# EAGLE design E6_Esp32_TS26C01_v3 (EAGLE 6.6.0)

## Sheet 1 of 2
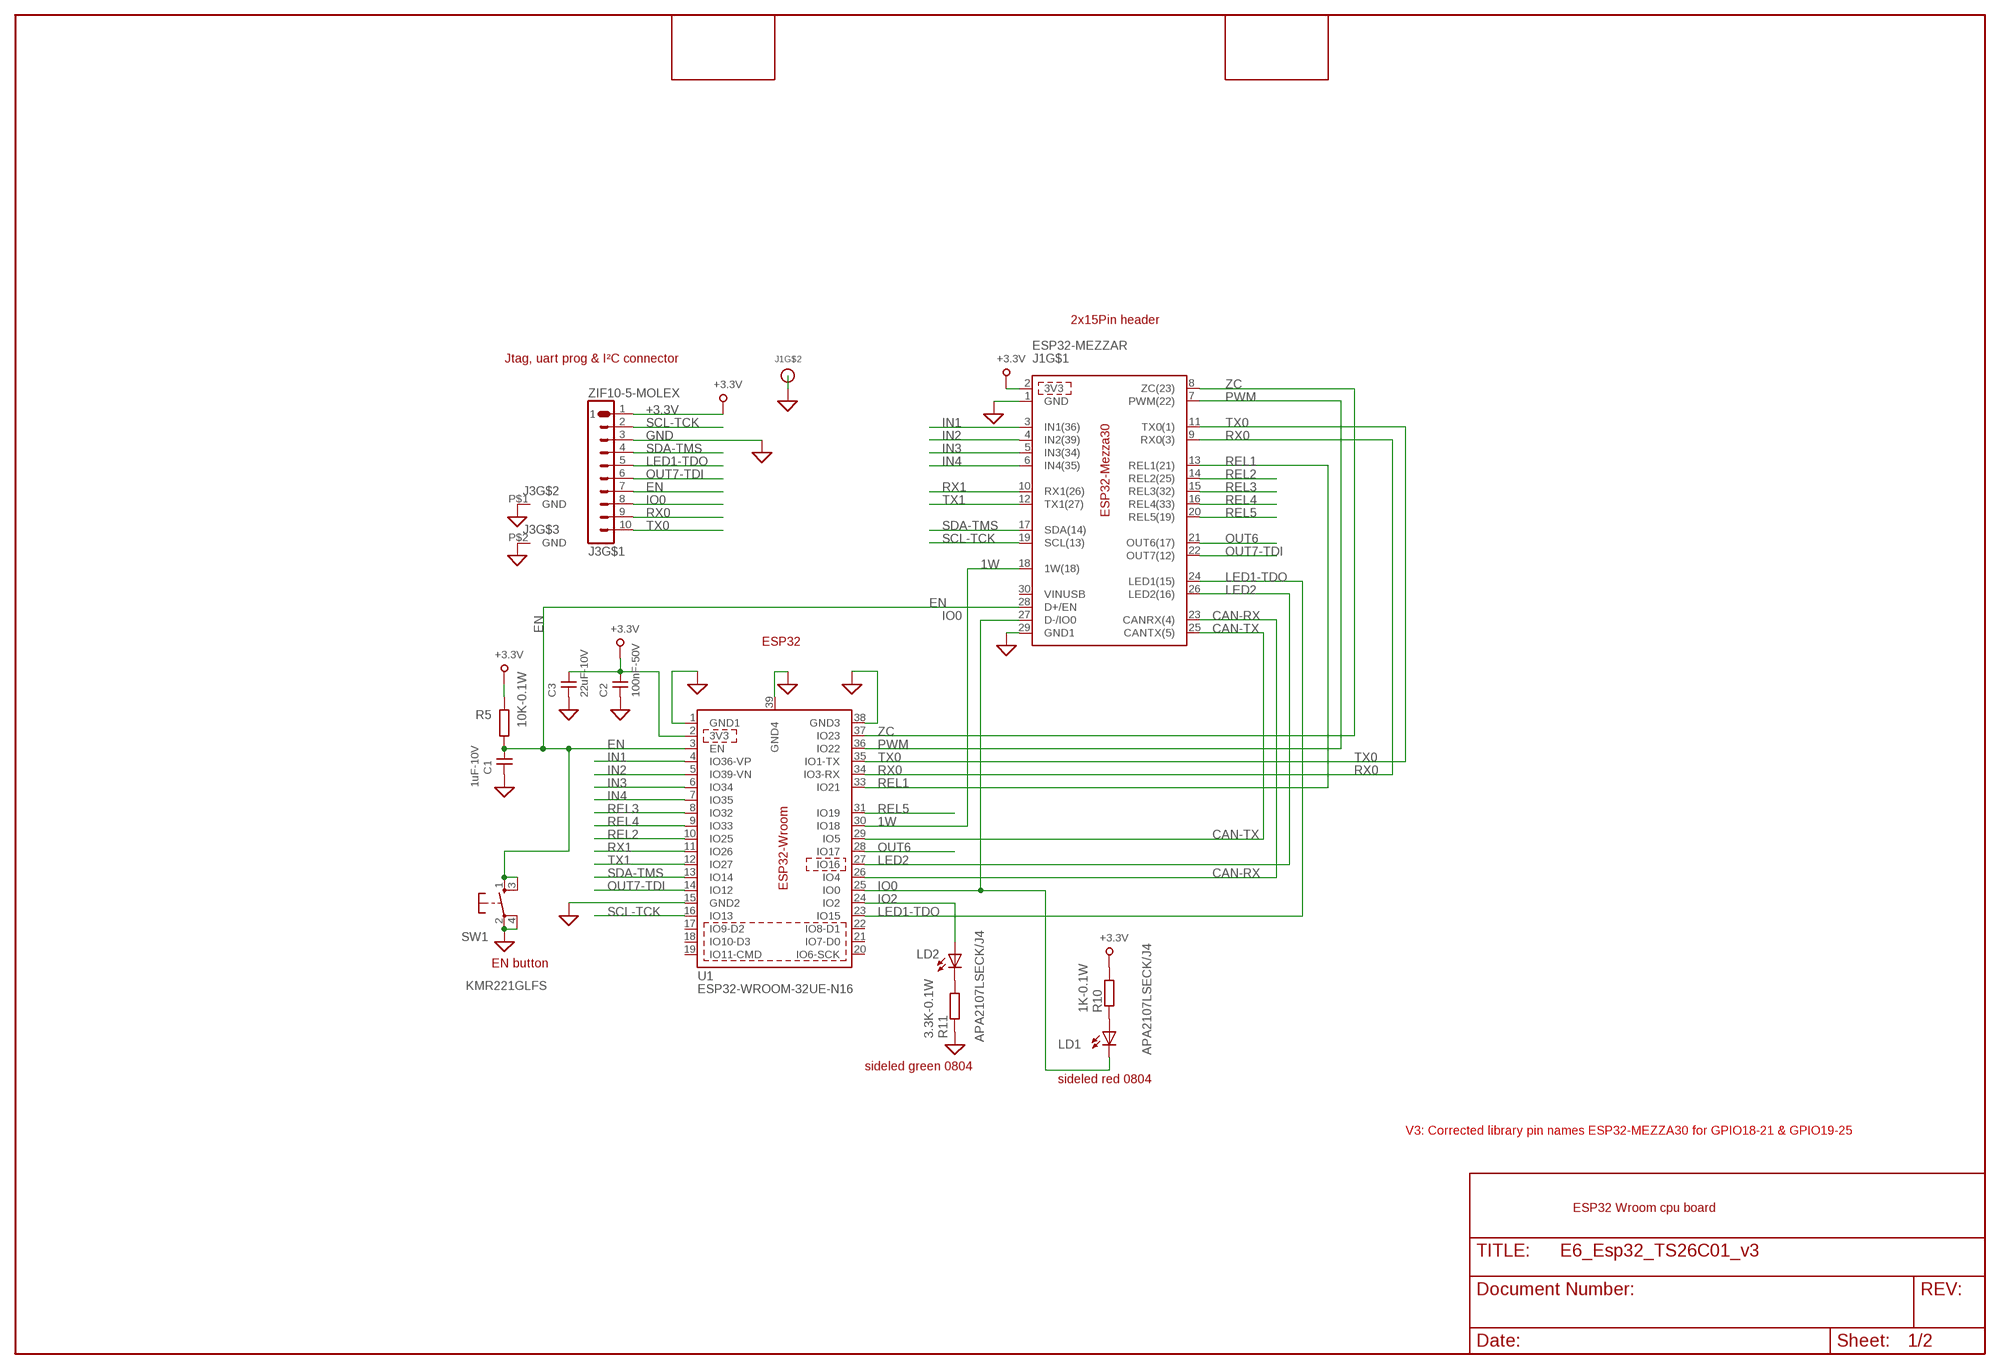
[diagram p0: schematic, sheet 1]

### Parts
C1  1uF-10V  CAP-0603-L  [C0603]
C2  100nF-50V  CAP-0603-L  [C0603]
C3  22uF-10V  CAP-0603-L  [C0603]
J1  ESP32-MEZZAR  [ESP32-MEZZA25-R]
J3  ZIF10-5-MOLEX  ZIF10-5-MOLEXSTD  [52746-1071-J]
LD1  APA2107LSECK/J4  SIDELED_0805  [SIDELED_0805]
LD2  APA2107LSECK/J4  SIDELED_0805  [SIDELED_0805]
R5  10K-0.1W  R-EU_R0603-S  [0603]
R10  1K-0.1W  R-EU_R0603-S  [0603]
R11  3.3K-0.1W  R-EU_R0603-S  [0603]
SW1  KMR221GLFS  SW-TACT-NOGNDSIDE  [SW-KMS-HOLE-NOGND]
U1  ESP32-WROOM-32UE-N16  ESP32-WROOM-UE  [ESP32-WROOM-32UE]

### Nets
1W: J1.18(1W(18)) U1.30(IO18)
+3.3V: C2.2 C3.2 J1.2(3V3) J3.1 R5.1 R10.1 U1.2(3V3)
CAN-RX: J1.23(CANRX(4)) U1.26(IO4)
CAN-TX: J1.25(CANTX(5)) U1.29(IO5)
EN: C1.2 J1.28(D+/EN) J3.7 R5.2 SW1.1(S) SW1.3(S) U1.3(EN)
GND: C1.1 C2.1 C3.1 J1.1(GND) J1.29(GND1) J1.31 J3.3 J3.P$1(GND) J3.P$2(GND) R11.2 SW1.2(P) SW1.4(P) U1.1(GND1) U1.15(GND2) U1.38(GND3) U1.39(GND4)
IN1: J1.3(IN1(36)) U1.4(IO36-VP)
IN2: J1.4(IN2(39)) U1.5(IO39-VN)
IN3: J1.5(IN3(34)) U1.6(IO34)
IN4: J1.6(IN4(35)) U1.7(IO35)
IO0: J1.27(D-/IO0) J3.8 LD1.C U1.25(IO0)
IO2: LD2.A U1.24(IO2)
LED1-TDO: J1.24(LED1(15)) J3.5 U1.23(IO15)
LED2: J1.26(LED2(16)) U1.27(IO16)
N$3: LD1.A R10.2
N$4: LD2.C R11.1
OUT6: J1.21(OUT6(17)) U1.28(IO17)
OUT7-TDI: J1.22(OUT7(12)) J3.6 U1.14(IO12)
PWM: J1.7(PWM(22)) U1.36(IO22)
REL1: J1.13(REL1(21)) U1.33(IO21)
REL2: J1.14(REL2(25)) U1.10(IO25)
REL3: J1.15(REL3(32)) U1.8(IO32)
REL4: J1.16(REL4(33)) U1.9(IO33)
REL5: J1.20(REL5(19)) U1.31(IO19)
RX0: J1.9(RX0(3)) J3.9 U1.34(IO3-RX)
RX1: J1.10(RX1(26)) U1.11(IO26)
SCL-TCK: J1.19(SCL(13)) J3.2 U1.16(IO13)
SDA-TMS: J1.17(SDA(14)) J3.4 U1.13(IO14)
TX0: J1.11(TX0(1)) J3.10 U1.35(IO1-TX)
TX1: J1.12(TX1(27)) U1.12(IO27)
ZC: J1.8(ZC(23)) U1.37(IO23)
Unconnected: J1.30(VINUSB) U1.17(IO9-D2) U1.18(IO10-D3) U1.19(IO11-CMD) U1.20(IO6-SCK) U1.21(IO7-D0) U1.22(IO8-D1)

### Notes on the sheet
- 2x15Pin header
- Jtag, uart prog & I²C connector
- ESP32
- EN button
- sideled green 0804
- sideled red 0804
- V3: Corrected library pin names ESP32-MEZZA30 for GPIO18-21 & GPIO19-25
- ESP32 Wroom cpu board

## Sheet 2 of 2
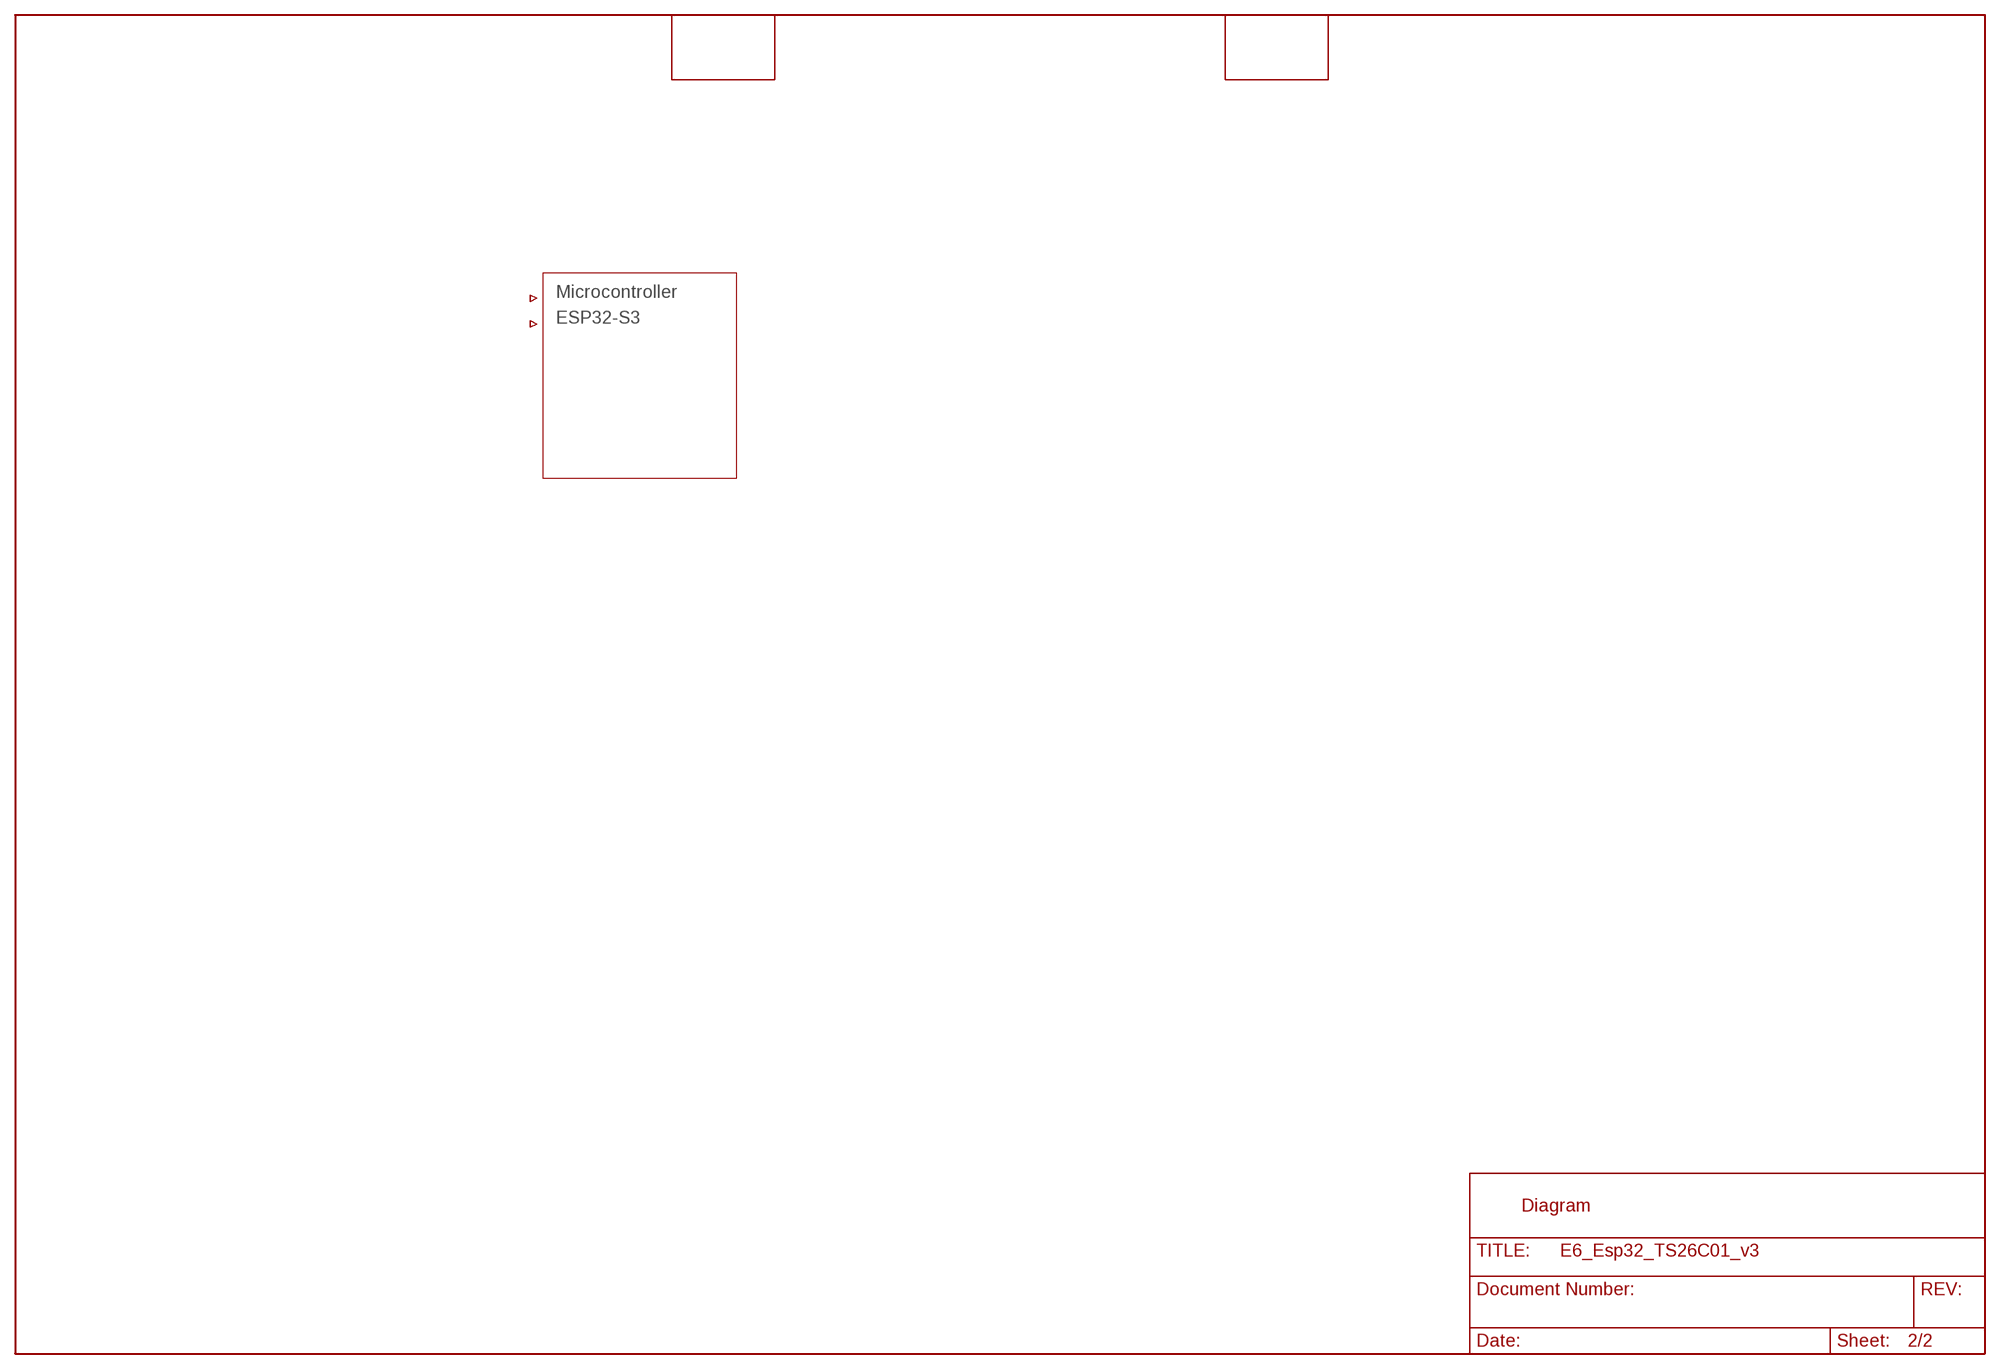
[diagram p1: schematic, sheet 2]

### Notes on the sheet
- Microcontroller
- ESP32-S3
- Diagram

## Power pins joined to a net without a drawn wire
GND: J3.P$3(GND) J3.P$5(GND)

## Library data of the parts
C1-C3 = JLB_smd:CAP-0603
J1 = JLB_Processor:ESP32-MEZZA: Module ESP32 40mm 2x15x2.0mm vertical, horizontal, normal, reverse
J3 = JLB_Connec:ZIF10-5-MOLEX
LD1 LD2 = JLB_Display:SIDELED_0805: Sideled 0805 kingbright APA2107 can be used for standard led
R5 R10 R11 = JLB_smd:R-EU_: RESISTOR, European symbol
SW1 = JLB_Connec:SW-TACT-NOGND: Tactile button C&K KMR
U1 = JLB_Processor:ESP32-WROOM-UE: SOC ESP32-Wroom E antene pcb

## Board
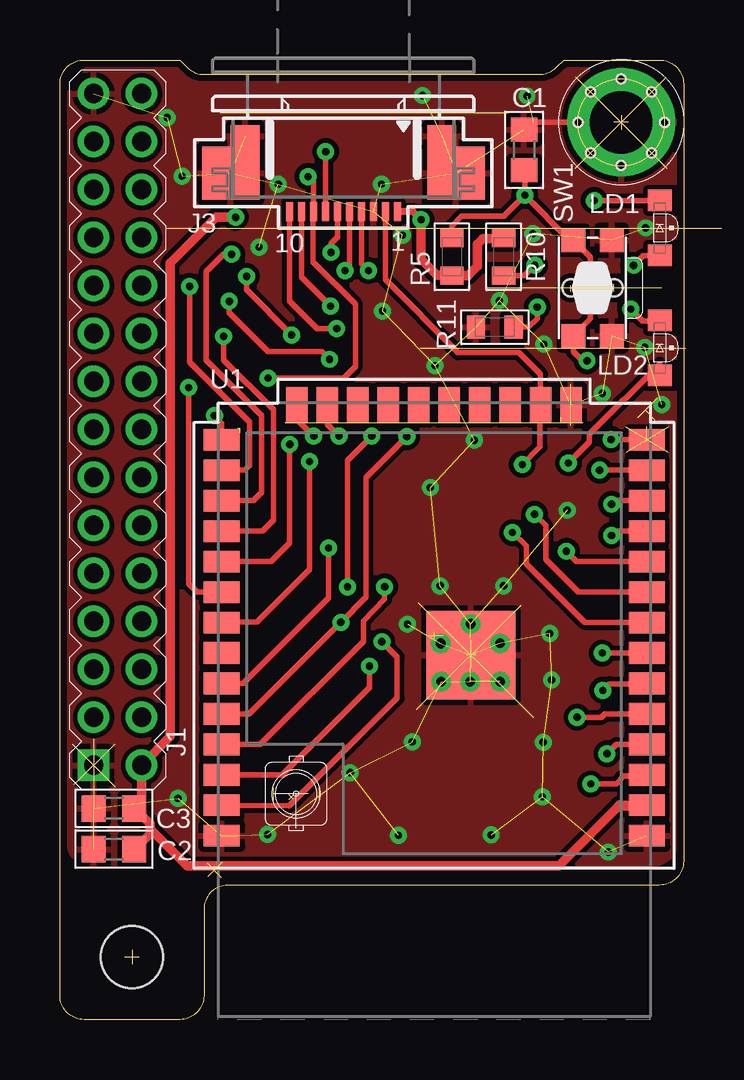
[diagram p2: board, top side]
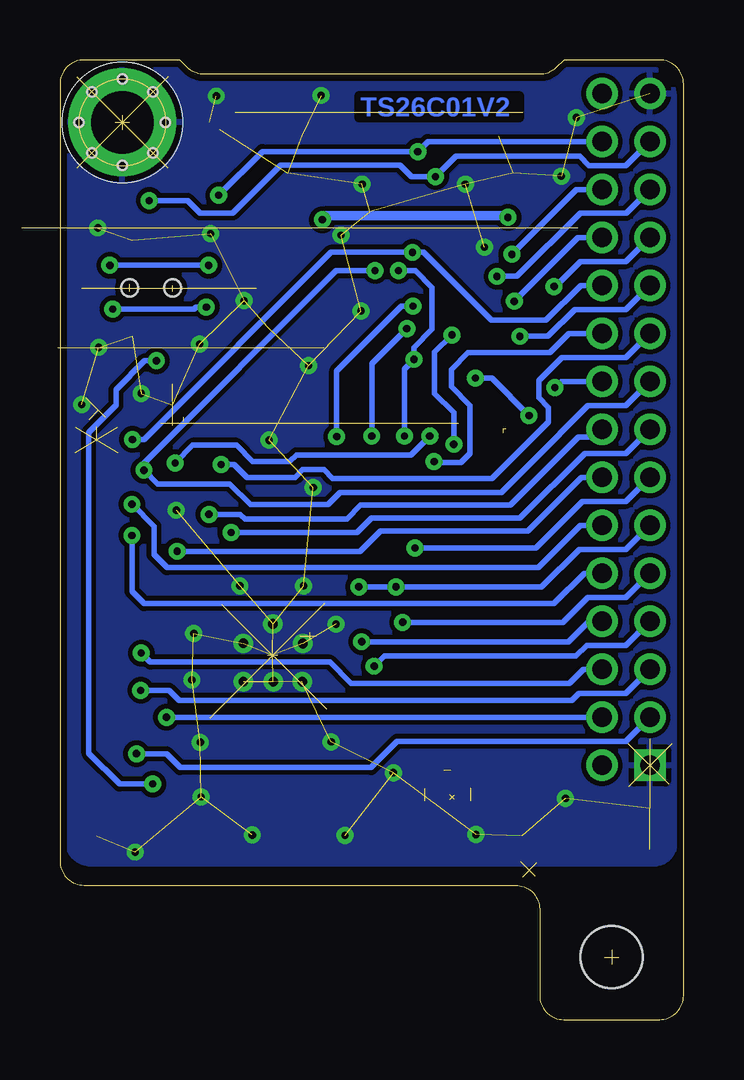
[diagram p3: board, bottom side, seen from below]

Size 26 x 40 mm. Coordinates in mm from the lower left corner, seen from the top.
Copper layers (1*16): Top 0.035mm / dielectric 1.5mm / Bottom 0.035mm
Design rules "default": minimum track width 9mil, minimum drill 10mil, track to track 7mil, track to pad 7mil, pad to pad 7.5mil, via to via 8mil, smd to smd 0mil, copper to edge 10mil, drill to drill 8mil, minimum pad ring 10mil, minimum via ring 8mil, stop-mask expansion 1mil, vias tented up to drill 19mil, thermal gap 9mil
bRestrict: 4 lines
Milling: 13 lines

### Footprints (pad centres in the part's own frame; a part is rotated, then mirrored left to right if it is on the bottom)
C0603 = smd 1 x 1.1: 1 -0.85,0; 2 0.85,0
ESP32-MEZZA25-R = drill 0.8 square: 1 1.4,10.6 | drill 0.8: 2 3.4,10.6; 3 1.4,12.6; 4 3.4,12.6; 5 1.4,14.6; 6 3.4,14.6; 7 1.4,16.6; 8 3.4,16.6; 9 1.4,18.6; 10 3.4,18.6; 11 1.4,20.6; 12 3.4,20.6; 13 1.4,22.6; 14 3.4,22.6; 15 1.4,24.6; 16 3.4,24.6; 17 1.4,26.6; 18 3.4,26.6; 19 1.4,28.6; 20 3.4,28.6; 21 1.4,30.6; 22 3.4,30.6; 23 1.4,32.6; 24 3.4,32.6; 25 1.4,34.6; 26 3.4,34.6; 27 1.4,36.6; 28 3.4,36.6; 29 1.4,38.6; 30 3.4,38.6 | drill 2.6 pad 4.5: 31 23.4,37.4 | hole 0.381: 22.13,38.67; 24.665,36.131; 23.4,39.2; 24.67,38.67; 25.2,37.4; 23.4,35.6; 22.134,36.125; 21.6,37.4 | hole 2.6: 3,2.6
52746-1071-J = smd 0.3 x 0.8: 1 -2.25,2.5; 2 -1.75,2.5; 3 -1.25,2.5; 4 -0.75,2.5; 5 -0.25,2.5; 6 0.25,2.5; 7 0.75,2.5; 8 1.25,2.5; 9 1.75,2.5; 10 2.25,2.5 | smd 2.4 x 2.2: P$1 -4.7,0.9; P$2 4.7,0.9 | smd 1.2 x 0.9: P$3 4.1,-0.65; P$5 -4.1,-0.65
SIDELED_0805 = smd 1 x 0.9: A 0,-1.15; C 0,1.15
0603 = smd 0.965 x 0.762: 1 0,0.787; 2 0,-0.787
SW-KMS-HOLE-NOGND = smd 1 x 1: 1 0.8,-2; 2 -0.8,-2; 3 0.8,2; 4 -0.8,2 | hole 0.7: -0.9,0; 0.9,0
ESP32-WROOM-32UE = smd 1.5 x 0.9: 1 -8.874,8.34; 2 -8.874,7.07; 3 -8.874,5.8; 4 -8.874,4.53; 5 -8.874,3.26; 6 -8.874,1.99; 7 -8.874,0.72; 8 -8.874,-0.55; 9 -8.874,-1.82; 10 -8.874,-3.09; 11 -8.874,-4.36; 12 -8.874,-5.63; 13 -8.874,-6.9; 14 -8.874,-8.17; 25 8.855,-8.17; 26 8.855,-6.9; 27 8.855,-5.63; 28 8.855,-4.36; 29 8.855,-3.09; 30 8.855,-1.82; 31 8.855,-0.55; 32 8.855,0.72; 33 8.855,1.99; 34 8.855,3.26; 35 8.855,4.53; 36 8.855,5.8; 37 8.855,7.07; 38 8.855,8.34 | smd 0.9 x 1.5: 15 -5.71,-9.621; 16 -4.44,-9.621; 17 -3.17,-9.621; 18 -1.9,-9.621; 19 -0.63,-9.621; 20 0.64,-9.621; 21 1.91,-9.621; 22 3.18,-9.621; 23 4.45,-9.621; 24 5.72,-9.621 | smd 3.7 x 3.7: 39 -1.53,0.81

### Placement (x,y rotation side)
C1  19.35,36.25 270 top
C2  2.25,7.1 0 top
C3  2.25,8.8 0 top
J1  0,0 0 top
J3  11.82,36.18 180 top
LD1  25,33 0 top
LD2  25,28 0 top
R5  16.34,31.8 180 top
R10  18.5,31.8 0 top
R11  18.13,28.86 270 top
SW1  22.2,30.5 180 top
U1  15.6,16 180 top

### Tracks (layer width: path | path; a pad name or v marks a point on that pad's centre or on a via)
1W  (via drill 0.3)
  Top 0.23: 6.76,17.84 U1.30 | v5.36,26.34 5.36,18.18 5.72,17.82 U1.30 | U1.30
  Bottom 0.23: J1.18 5.1,26.6 v5.36,26.34
+3.3V  (via drill 0.3)
  Top 0.3: v15.06,33.34 14.72,33.68 J3.1 | R10.1 18.4,32.58 18.39,32.59
  Top 0.4: 23.3,8.9 20.8,6.4 5.3,6.4 3.75,7.95 | 3.75,7.95 3.75,8.15 C3.2 3.4,9.1 J1.2 4.6,11.8 4.6,31.53 6.51,33.44 v7.32,33.44 | 3.75,7.95 3.75,7.75 C2.2 | v15.06,33.34 15.06,31.7 15.72,31.04 16.34,31.04 R5.1 17.01,31.01 17.4,31.4 17.4,32.32 17.64,32.56 18.5,32.56 R10.1
  Top 0.406: U1.2 | 23.3,8.9 23.33,8.93 U1.2
  Bottom 0.4: v7.32,33.44 7.3,33.44 7.38,33.52 14.88,33.52 v15.06,33.34
CAN-RX  (via drill 0.3)
  Top 0.23: U1.26 7.7,22.9 7.9,23.1 7.9,24.9 5.4,27.41 v5.4,30.56
  Bottom 0.23: J1.23 2.4,31.6 4.3,31.6 5.22,30.68 v5.4,30.56
CAN-TX  (via drill 0.3)
  Top 0.23: U1.29 8.81,19.09 9.58,19.86 v9.58,23.98 | v7.78,30.98 7.78,30.42 v9.66,28.54
  Bottom 0.23: J1.25 2.39,33.61 4.31,33.61 6.94,30.98 v7.78,30.98 | v9.58,23.98 9.58,25.3 10.38,26.1 10.38,27.82 v9.66,28.54
EN  (via drill 0.3)
  Top 0.23: U1.3 24.47,10.15 23.52,10.15 23.19,9.82 v22.13,9.82 | J3.7 v11.08,36.18 | C1.2 19.38,35.38 v19.38,34.36 | v21.98,27.46 21.78,27.46 21.4,27.84 SW1.3 | SW1.3 21.4,28.52 | v19.38,34.36 21.24,32.5 SW1.1 22.12,31.78 22.12,29.22 SW1.3 | R5.2 16.34,33.08 16.74,33.48 18.5,33.48 v19.38,34.36
  Bottom 0.23: v22.13,9.82 23.52,9.82 24.8,11.1 24.8,24.47 23.66,25.61 23.66,26.26 22.46,27.46 v21.98,27.46 | J1.28 10.66,36.6 v11.08,36.18 17.56,36.18 v19.38,34.36
GND  (via drill 0.3, 0.4)  (56 unrouted)
  Top 0.23: C1.1 19.42,37.1 19.44,37.08 19.76,37.4 J1.31
  other vias: 12.1,10.29 14.49,16.48 17.12,16.49 17.11,14.09 18.35,15.68 18.35,14.09 15.87,15.68 15.9,14.08 13.45,29.54 20.5,14.16 22.86,6.98 20.11,9.28 17.98,7.69 14.12,7.68 15.64,27.26 21.15,21.23 4.47,37.6 15.44,22.18 17.28,24.15 4.92,9.22 15.12,38.52 20.15,11.56 14.69,11.57 20.42,16.09 8.66,7.71 25.09,25.64 15.85,18.08 18.5,18.08 19.72,32.76 8.3,32.2 20.18,28.16 18.32,29.96 5.1,35.16 9.1,34.82 13.4,34.82 24.42,33 24.38,28.02 19.48,38.5 22.62,26.1 14.28,32.7
  pour Top (isolate 0.2): 1.7,39.7 arc90 0.4,38.4 0.4,7.32 arc90 1.22,6.5 24.7,6.5 arc90 25.7,7.5 25.7,38.62 arc90 24.62,39.7
  pour Bottom (isolate 0.2): 1.7,39.7 arc90 0.4,38.4 0.4,7.32 arc90 1.22,6.5 24.7,6.5 arc90 25.7,7.5 25.7,38.62 arc90 24.62,39.7
IN1  (via drill 0.3)
  Top 0.23: U1.4 23.19,11.46 v22.81,11.08
  Bottom 0.23: J1.3 2.4,11.6 11.94,11.6 13.03,10.51 20.99,10.51 21.56,11.08 v22.81,11.08
IN2  (via drill 0.3)
  Top 0.23: v21.56,12.6 22.58,12.6 22.72,12.74 U1.5 | U1.5 | U1.5
  Bottom 0.23: J1.4 v21.56,12.6
IN3  (via drill 0.3)
  Top 0.23: U1.6 22.91,14 v22.63,13.72
  Bottom 0.23: J1.5 2.4,13.6 4.36,13.6 4.66,13.3 21.03,13.3 21.45,13.72 v22.63,13.72
IN4  (via drill 0.3)
  Top 0.23: U1.7 | U1.7 | v22.61,15.28 U1.7
  Bottom 0.23: J1.6 4.18,14.6 4.76,14.02 13.86,14.02 14.74,14.9 22.23,14.9 v22.61,15.28
IO0  (via drill 0.3)
  Top 0.23: U1.25 6.75,24.88 v6.44,25.18 | v8.68,26.74 11.84,26.74 12.32,27.22 12.32,29.82 10.56,31.58 10.56,33.64 10.57,33.65 J3.8 10.58,34.9 v10.34,35.14 | LD1.C 24.98,34.14 v22.28,34.14
  Bottom 0.23: v6.44,25.18 8,26.74 v8.68,26.74 | J1.27 2.4,35.6 3.95,35.6 4.33,35.98 9.5,35.98 v10.34,35.14 11.34,35.14 11.82,35.62 16.8,35.62 18.8,33.62 20.16,33.62 20.68,34.14 v22.28,34.14
IO2  (via drill 0.3)
  Top 0.23: U1.24 9.88,25.14 9.88,25.02 v10.58,24.32 | v21.2,23.2 22.08,24.08 22.08,24.4 25,27.32 LD2.A
  Bottom 0.23: v10.58,24.32 11.36,23.54 16.14,23.54 16.42,23.26 17.96,23.26 18.64,23.94 20.46,23.94 v21.2,23.2
LED1-TDO  (via drill 0.3)
  Top 0.23: U1.23 11.15,24.81 v11.64,24.32 | v7.06,29.94 7.06,29.46 8.68,27.84 10.92,27.84 v11.24,27.52 | J3.5 12.07,31.41 v11.88,31.22
  Bottom 0.23: J1.24 4.4,32.6 v7.06,29.94 | v11.64,24.32 11.64,27.12 v11.24,27.52 11.24,28.02 10.48,28.78 10.48,30.52 11.18,31.22 v11.88,31.22
LED2  (via drill 0.3)
  Top 0.23: U1.27 8.07,21.63 8.4,21.96 8.4,25.18 6.1,27.48 6.1,31.18 6.82,31.9 v7.16,31.9
  Bottom 0.23: J1.26 4.46,34.6 v7.16,31.9
N$3  (via drill 0.3)
  Top 0.23: LD1.A 24.32,31.84 v23.92,31.44 | R10.2 19.37,31.01 v19.8,31.44
  Bottom 0.23: v19.8,31.44 v23.92,31.44
N$4  (via drill 0.3)
  Top 0.23: R11.1 19.54,28.86 19.9,29.22 v19.9,29.7 | v23.8,29.62 24.3,29.12 25.02,29.12 LD2.C
  Bottom 0.23: v19.9,29.7 20.32,29.7 20.4,29.62 v23.8,29.62
OUT6  (via drill 0.3)
  Top 0.23: U1.28 8.44,20.36 8.9,20.82 8.9,25.42 6.82,27.5 v6.82,28.48
  Bottom 0.23: J1.21 2.4,29.6 4.54,29.6 5.66,28.48 v6.82,28.48
OUT7-TDI  (via drill 0.3)
  Top 0.23: U1.14 v22.98,24.18 | J3.6 11.57,32.61 11.3,32.34 v11.3,31.98
  Bottom 0.23: J1.22 4.29,30.6 5.73,29.16 8.02,29.16 10.84,31.98 v11.3,31.98 14.7,31.98 22.5,24.18 v22.98,24.18
PWM  (via drill 0.3)
  Top 0.23: U1.36 | U1.36 | U1.36 9.26,10.2 12.9,13.84 v12.9,14.73
  Bottom 0.23: J1.7 2.4,15.6 4.04,15.6 4.48,15.16 12.47,15.16 v12.9,14.73
REL1  (via drill 0.3)
  Top 0.23: U1.33 7.64,14.02 11.2,17.58 v11.2,19.66
  Bottom 0.23: J1.13 2.4,21.6 4.22,21.6 6.16,19.66 v11.2,19.66
REL2  (via drill 0.3)
  Top 0.23: U1.10 21.54,19.1 v21.12,19.52
  Bottom 0.23: J1.14 4.26,22.6 6.5,20.36 12.64,20.36 13.48,19.52 v21.12,19.52
REL3  (via drill 0.3)
  Top 0.23: v18.87,20.3 19.44,19.73 19.44,19 21.88,16.56 U1.8
  Bottom 0.23: J1.15 2.4,23.6 4.12,23.6 6.82,20.9 13.02,20.9 13.62,20.3 v18.87,20.3
REL4  (via drill 0.3)
  Top 0.23: v19.79,21.06 20.26,20.59 20.26,19.18 21.62,17.82 U1.9 | U1.9 | U1.9
  Bottom 0.23: J1.16 3.74,24.28 4.38,24.28 7.22,21.44 13.46,21.44 14.04,20.86 18.28,20.86 18.48,21.06 v19.79,21.06
REL5  (via drill 0.3)
  Top 0.23: U1.31 6.79,16.55 6.82,16.58 8.22,16.58 10.4,18.76 v10.4,23.26
  Bottom 0.23: J1.20 4.78,28.6 5.58,27.8 8.98,27.8 9.68,27.1 9.68,26.38 8.9,25.6 8.9,23.6 9.28,23.22 10.3,23.22 v10.4,23.26
RX0  (via drill 0.3)
  Top 0.23: 6.96,12.72 6.94,12.74 U1.34 7.88,12.74 11.72,16.58 v11.72,16.57 v11.71,16.56 12.76,17.61 12.76,22.6 v14.46,24.3 | J3.9 10.07,30.95 v11.28,29.74
  Bottom 0.23: J1.9 2.4,17.6 4,17.6 5.04,16.56 v11.71,16.56 | v14.46,24.3 14.46,27.04 11.76,29.74 v11.28,29.74
RX1  (via drill 0.3)
  Top 0.23: U1.11 | U1.11 | v23,20.18 23.18,20.36 U1.11
  Bottom 0.23: J1.10 4.14,18.6 5.4,17.34 22.49,17.34 23,17.85 v23,20.18 23,20.2
SCL-TCK  (via drill 0.3)
  Top 0.23: v19.28,23.14 20.02,23.88 20.02,25.62 U1.16 | J3.2 13.57,30.85 16.6,27.8 19.14,27.8 20.04,26.9 U1.16 | U1.16
  Bottom 0.23: J1.19 2.4,27.6 5.08,27.6 6.04,26.64 6.04,25.92 5.64,25.52 5.64,24.9 7.98,22.56 14.63,22.56 15,22.92 15.88,22.92 16.2,22.6 18.2,22.6 18.74,23.14 v19.28,23.14
SDA-TMS  (via drill 0.3)
  Top 0.23: U1.13 | U1.13 | v22.5,22.9 U1.13 | J3.4 12.57,31.51 v12.86,31.22
  Bottom 0.23: J1.17 2.4,25.6 3.98,25.6 6.33,23.23 7.6,21.96 14.32,21.96 14.82,21.46 18.06,21.46 18.93,22.33 21.93,22.33 v22.5,22.9 22.52,23.18 14.5,31.22 v12.86,31.22
TX0  (via drill 0.3)
  Top 0.23: v11.99,18.04 11.99,23.31 v13,24.32 | U1.35 8.34,11.47 12.65,15.77 12.65,16.62 13.54,17.53 v13.54,18.04 | J3.10 9.57,29.95 10.72,28.8 v11.54,28.8
  Bottom 0.23: J1.11 2.4,19.6 4.34,19.6 5.92,18.04 v11.99,18.04 v13.54,18.04 | v13,24.32 13,27.34 v11.54,28.8
TX1  (via drill 0.3)
  Top 0.23: U1.12 23.16,21.64 v23,21.48
  Bottom 0.23: J1.12 4.3,20.6 6.06,18.84 21.54,18.84 22.08,19.38 22.08,20.56 v23,21.48
ZC  (via drill 0.3)
  Top 0.23: U1.37 9.56,8.91 14.06,13.4 14.06,15.11 v13.42,15.75
  Bottom 0.23: J1.8 3.95,16.6 4.8,15.75 v13.42,15.75

### Text on the board
Bottom: TS26C01V2
tNames: 10 | 1
bStop: TS26C01V2
Milling: Grid dimension, meca, leds: 0.1mm, placement: 1 mil ou 0.02mm | Max size: 40x26mm | Remaining DRC errors: 19 (hole and pcb mane on bottom)
Measures: 26 | 2.6 | R 1.0 | 2.6 | 4.4 | 5.0 | 40 | 34.4 | 8.0 | 5.6 | 1.6 | 3.0 | 2.6 | 6
Document: Ref : TS26C01 | Scale: 2